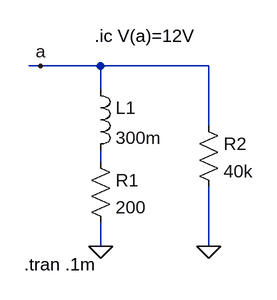
[diagram p0: schematic Draft2.asc]
Draft2.asc, the LTspice schematic file:
Version 4
SHEET 1 880 680
WIRE 80 80 64 80
WIRE 160 80 80 80
WIRE 304 80 160 80
WIRE 160 112 160 80
WIRE 304 160 304 80
WIRE 160 208 160 192
WIRE 160 320 160 288
WIRE 304 320 304 240
FLAG 160 320 0
FLAG 304 320 0
FLAG 80 80 a
SYMBOL ind 144 96 R0
SYMATTR InstName L1
SYMATTR Value 300m
SYMBOL res 144 192 R0
SYMATTR InstName R1
SYMATTR Value 200
SYMBOL res 288 144 R0
SYMATTR InstName R2
SYMATTR Value 40k
TEXT 152 40 Left 2 !.ic V(a)=12V
TEXT 58 344 Left 2 !.tran .1m

The netlist it stands for:
* Draft2.asc
L1 a N001 300m
R1 N001 0 200
R2 a 0 40k
.ic V(a)=12V
.tran .1m
.backanno
.end